# Altium project osu_keyboard.PrjPcb
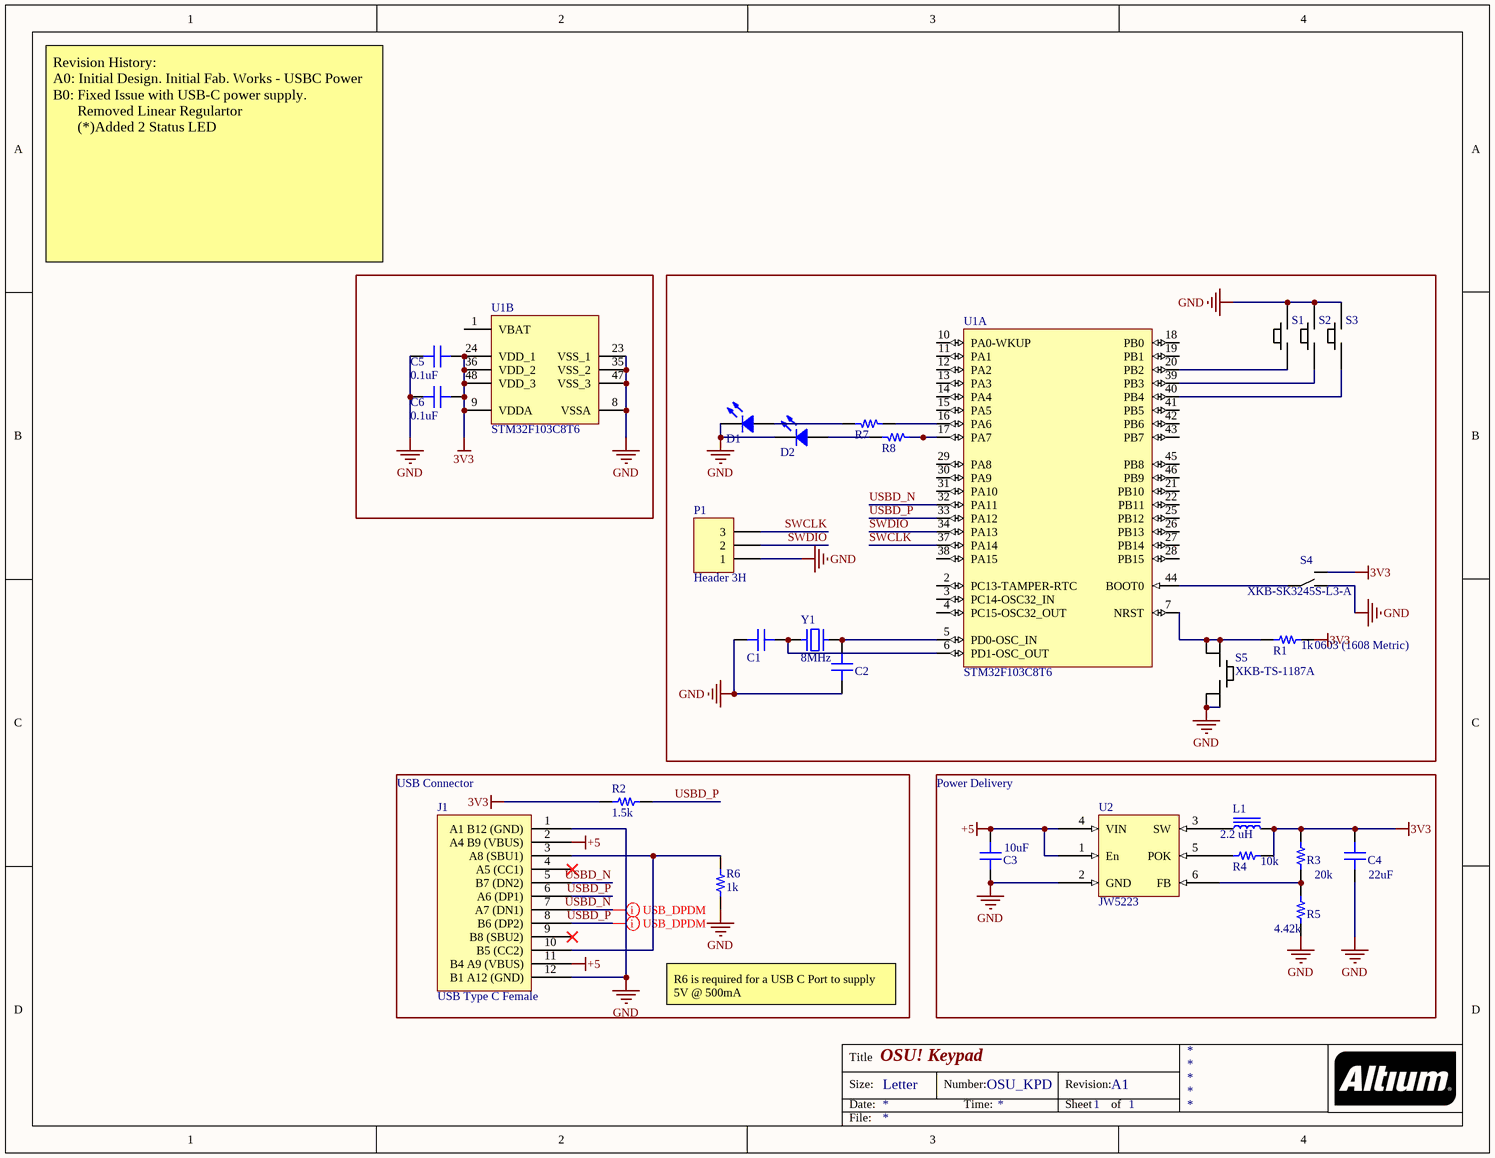
[diagram p0: osu_keyboard.SchDoc]
1 sheet, 27 parts. Net scope: global (net labels, ports and power ports of the same name join across sheets).
Board file: OSU_KBD.PcbDoc

## Sheet osu_keyboard.SchDoc: OSU! Keypad
size Letter; DrawnBy: Yaotian Feng; Engineer: Yaotian Feng; DocumentNumber: OSU_KPD; Revision: A1; SheetNumber: 1; SheetTotal: 1

### Parts
C1  22pF  [CAP 0603/1608]  (value not drawn)
C2  22pF  [CAP 0603/1608]  (value not drawn)
C3  10uF  [CAP 0805/2012]
C4  22uF  [CAP 0805/2012]
C5  0.1uF  [CAP 0603/1608]
C6  0.1uF  [CAP 0603/1608]
D1  Green  [LED 0805/2012 GREEN]  (value not drawn)
D2  Blue  [LED 0805/2012 BLUE]  (value not drawn)
J1  USB Type C Female  [USB Type C Female]
L1  2.2 uH  [INDP1722X10N]
P1  Header 3H  [HDR1X3H]
R1  1k  Device Package: 0603 (1608 Metric)  [RES 0603/1608]
R2  1.5k  [RES 0603/1608]
R3  20k  [RES 0805/2012]
R4  10k  [RES 0805/2012]
R5  4.42k  [RES 0805/2012]
R6  1k  [RES 0603/1608]
R7  330  [RES 0603/1608]  (value not drawn)
R8  330  [RES 0603/1608]  (value not drawn)
S1  CherryMXSwitch  [CherryMX]  (value not drawn)
S2  CherryMXSwitch  [CherryMX]  (value not drawn)
S3  CherryMXSwitch  [CherryMX]  (value not drawn)
S4  XKB-SK3245S-L3-A  [XKB-SK-3245S]
S5  XKB-TS-1187A  [XKB-RS-1187A]
U1  STM32F103C8T6  [STM-LQFP48_N]  (parts A,B of 2)
U2  JW5223  [SOT23-6N]
Y1  8MHz  [TAXM_SMD_CRYSTAL]

### Blocks framed on the sheet
USB Connector: J1 R2 R6
Power Delivery: C3 C4 L1 R3-R5 U2

### Nets
3V3: C4.2 C5.2 C6.2 L1.2 R1.2 R2.2 R3.1 R4.2 S4.1 U1.9(VDDA) U1.24(VDD_1) U1.36(VDD_2) U1.48(VDD_3)
+5: C3.2 J1.2(A4_B9_(VBUS)) J1.11(B4_A9_(VBUS)) U2.1(En) U2.4(VIN)
GND: C1.1 C2.2 C3.1 C4.1 C5.1 C6.1 D1.2 D2.2 J1.1(A1_B12_(GND)) J1.12(B1_A12_(GND)) P1.1 R5.1 R6.2 S1.2 S2.2 S3.2 S4.3 S5.3 S5.4 U1.8(VSSA) U1.23(VSS_1) U1.35(VSS_2) U1.47(VSS_3) U2.2(GND)
SWCLK: P1.3 U1.37(PA14)
SWDIO: P1.2 U1.34(PA13)
USBD_N: J1.5(B7_(DN2)) J1.7(A7_(DN1)) U1.32(PA11)
USBD_P: J1.6(A6_(DP1)) J1.8(B6_(DP2)) R2.1 U1.33(PA12)
NetC1_2: C1.2 U1.6(PD1-OSC_OUT) Y1.1
NetC2_1: C2.1 U1.5(PD0-OSC_IN) Y1.3
NetD1_1: D1.1 R7.2
NetD2_1: D2.1 R8.2
NetJ1_3: J1.3(A8_(SBU1)) J1.10(B5_(CC2)) R6.1
NetL1_1: L1.1 U2.3(SW)
NetR1_1: R1.1 S5.1 S5.2 U1.7(NRST)
NetR3_2: R3.2 R5.2 U2.6(FB)
NetR4_1: R4.1 U2.5(POK)
NetR7_1: R7.1 U1.16(PA6)
NetR8_1: R8.1 U1.17(PA7)
NetS1_1: S1.1 U1.20(PB2)
NetS2_1: S2.1 U1.39(PB3)
NetS3_1: S3.1 U1.40(PB4)
NetS4_2: S4.2 U1.44(BOOT0)

Not connected (* = marked no-connect by the designer): J1 4(A5_(CC1))* 9(B8_(SBU2))*; U1 1(VBAT) 2(PC13-TAMPER-RTC) 3(PC14-OSC32_IN) 4(PC15-OSC32_OUT) 10(PA0-WKUP) 11(PA1) 12(PA2) 13(PA3) 14(PA4) 15(PA5) 18(PB0) 19(PB1) 21(PB10) 22(PB11) 25(PB12) 26(PB13) 27(PB14) 28(PB15) 29(PA8) 30(PA9) 31(PA10) 38(PA15) 41(PB5) 42(PB6) 43(PB7) 45(PB8) 46(PB9)

### Layout directives
differential pair: USBD_N, USBD_P

### Notes on the sheet
- Revision History:
  A0: Initial Design. Initial Fab. Works - USBC Power
  B0: Fixed Issue with USB-C power supply.
  Removed Linear Regulartor
  (*)Added 2 Status LED
- R6 is required for a USB C Port to supply 5V @ 500mA
- Title
- Size:
- Date:
- Letter
- Number:
- Time:
- Revision:
- Sheet
- of
- File:

### Library data of the parts
C1 C2 = C1608C0G1H220J080AA: CAP CER 22PF 50V C0G 0603; Manufacturer: TDK Corporation; TemperatureRange: -55C ~ 125C; TemperatureCoefficient: C0G, NP0; Tolerance: 5%; Value: 22pF; PartId: 4031; Part Number: C1608C0G1H220J080AA; Supplier 1: Digi-Key; Supplier Part Number 1: 445-1273-1-ND; ComponentLink1Description: Datasheet; ComponentLink1URL: https://product.tdk.com/info/en/catalog/datasheets/mlcc_commercial_general_en.pdf; ComponentLink2Description: Digi-Key listing; ComponentLink2URL: http://digikey.com/product-detail/en/C1608C0G1H220J080AA/445-1273-1-ND/567670; Voltage: 50V; Price: 0.14; Type: -; Device Package: 0603 (1608 Metric)
C3 = C2012X5R0J106K125AB: CAP CER 10UF 6.3V X5R 0805; Manufacturer: TDK Corporation; TemperatureRange: -55C ~ 85C; Tolerance: 10%; Value: 10uF; PartId: 4503; Part Number: C2012X5R0J106K125AB; Supplier 1: Digi-Key; Supplier Part Number 1: 445-4113-2-ND; ComponentLink1Description: Datasheet; ComponentLink1URL: https://product.tdk.com/info/en/catalog/datasheets/mlcc_commercial_general_en.pdf; ComponentLink2Description: Digi-Key listing; ComponentLink2URL: http://digikey.com/product-detail/en/C2012X5R0J106K125AB/445-4113-2-ND/1975460; TemperatureCoefficient: X5R; Voltage: 6.3V; Price: 0.0486; Type: -; Device Package: 0805 (2012 Metric)
C4 = C0805C226M9PACTU: CAP CER 22UF 6.3V X5R 0805; Manufacturer: Kemet; TemperatureRange: -55C ~ 85C; Tolerance: 20%; Value: 22uF; PartId: 13904; Part Number: C0805C226M9PACTU; Supplier 1: Digi-Key; Supplier Part Number 1: 399-4696-2-ND; ComponentLink1Description: Datasheet; ComponentLink1URL: http://www.kemet.com/docfinder?Partnumber=C0805C226M9PACTU; ComponentLink2Description: Digi-Key Listing; ComponentLink2URL: https://www.digikey.com/product-detail/en/kemet/C0805C226M9PACTU/399-4696-2-ND/992189; TemperatureCoefficient: X5R; Voltage: 6.3V; Price: 0.076; Device Package: 0805 (2012 Metric)
C5 C6 = C1608X7R1E104K080AA: CAP CER 0.1UF 25V X7R 0603; Manufacturer: TDK Corporation; TemperatureRange: -55C ~ 125C; Tolerance: 10%; Value: 0.1uF; PartId: 4029; Part Number: C1608X7R1E104K080AA; Supplier 1: Digi-Key; Supplier Part Number 1: 445-1316-1-ND; ComponentLink1Description: Datasheet; ComponentLink1URL: https://product.tdk.com/info/en/catalog/datasheets/mlcc_commercial_general_en.pdf; ComponentLink2Description: Digi-Key listing; ComponentLink2URL: http://digikey.com/product-detail/en/C1608X7R1E104K080AA/445-1316-1-ND/567697; TemperatureCoefficient: X7R; Voltage: 25V; Price: 0.14; Type: -; Device Package: 0603 (1608 Metric)
D1 = LTST-C171KGKT: LED GREEN CLEAR 0805 SMD; Manufacturer: Lite-On Inc.; Type: Surface Mount; Millicandela: 35mcd; Voltage Forward: 2V; Current (Test): 20mA; Viewing Angle: 130; Value: Green; PartId: 7080; Part Number: LTST-C171KGKT; Supplier 1: Digi-Key; Supplier Part Number 1: 160-1426-2-ND; ComponentLink1Description: Datasheet; ComponentLink1URL: http://optoelectronics.liteon.com/upload/download/DS22-2000-118/S_110_LTST-C171KGKT.pdf; ComponentLink2Description: Digi-Key Listing; ComponentLink2URL: http://www.digikey.ca/product-detail/en/LTST-C171KGKT/160-1426-2-ND/386799; Price: 0.0638; Device Package: 0805 (2012 Metric); Colour: Green; Lens Transparency: Clear
D2 = LTST-C171TBKT: LED BLUE CLEAR 0805 SMD; Manufacturer: Lite-On Inc.; Value: Green; Type: Surface Mount; Millicandela: 104mcd; Voltage Forward: 3.3V; Current (Test): 20mA; Viewing Angle: 130; PartId: 7084; Part Number: LTST-C171TBKT; Supplier 1: Digi-Key; Supplier Part Number 1: 160-1645-2-ND; ComponentLink1Description: Datasheet; ComponentLink1URL: http://optoelectronics.liteon.com/upload/download/DS22-2000-233/S_110_LTST-C171TBKT(0630).pdf; ComponentLink2Description: Digi-Key Listing; ComponentLink2URL: http://www.digikey.ca/product-detail/en/LTST-C171TBKT/160-1645-2-ND/388528; Price: 0.0939; Device Package: 0805 (2012 Metric); Colour: Blue; Lens Transparency: Clear
L1 = UHP252010NF: Inductor 2.2uH
P1 = Header 3H: Header, 3-Pin, Right Angle; LatestRevisionDate: 17-Jul-2002; LatestRevisionNote: Re-released for DXP Platform.; Publisher: Altium Limited
R1 R6 = ERJ-3EKF1001V: RES SMD 1K OHM 1% 1/10W 0603; Manufacturer: Panasonic Electronic Components; TemperatureRange: -55C ~ 155C; TemperatureCoefficient: 100ppm/C; PowerRating: 0.1W, 1/10W; Value: 1k; PartId: 885; Part Number: ERJ-3EKF1001V; Supplier 1: Digi-Key; Supplier Part Number 1: P1.00KHTR-ND; ComponentLink1Description: Datasheet; ComponentLink1URL: http://industrial.panasonic.com/www-cgi/jvcr13pz.cgi?E+PZ+3+AOA0002+ERJ3EKF1001V+7+WW; ComponentLink2Description: Digi-Key listing; ComponentLink2URL: http://digikey.com/product-detail/en/ERJ-3EKF1001V/P1.00KHTR-ND/196032; Tolerance: 1%; Price: 0.0038; Type: Thick Film
R2 = ERA-3ARW152V: RES SMD 1.5KOHM 0.05% 1/10W 0603; Manufacturer: Panasonic Electronic Components; TemperatureRange: -55C ~ 155C; TemperatureCoefficient: 10ppm/C; PowerRating: 0.1W, 1/10W; Value: 1.5k; PartId: 1863; Part Number: ERA-3ARW152V; Supplier 1: Digi-Key; Supplier Part Number 1: P1.5KBETR-ND; ComponentLink1Description: Datasheet; ComponentLink1URL: http://industrial.panasonic.com/lecs/www-data/pdf/AOA0000/AOA0000CE26.pdf; ComponentLink2Description: Digi-Key listing; ComponentLink2URL: http://digikey.com/product-detail/en/ERA-3ARW152V/P1.5KBETR-ND/3073692; Tolerance: 0.05%; Price: 0.3659; Type: Thin Film; Device Package: 0603 (1608 Metric)
R3 = ERA-6AEB203V: RES SMD 20K OHM 0.1% 1/8W 0805; Manufacturer: Panasonic Electronic Components; TemperatureRange: -55C ~ 155C; TemperatureCoefficient: 25ppm/C; PowerRating: 0.125W, 1/8W; Value: 20k; PartId: 2456; Part Number: ERA-6AEB203V; Supplier 1: Digi-Key; Supplier Part Number 1: P20KDATR-ND; ComponentLink1Description: Datasheet; ComponentLink1URL: http://industrial.panasonic.com/lecs/www-data/pdf/AOA0000/AOA0000CE26.pdf; ComponentLink2Description: Digi-Key listing; ComponentLink2URL: http://digikey.com/product-detail/en/ERA-6AEB203V/P20KDATR-ND/1465780; Tolerance: 0.1%; Price: 0.0653; Type: Thin Film; Device Package: 0805 (2012 Metric)
R4 = ERA-6AEB103V: RES SMD 10K OHM 0.1% 1/8W 0805; Manufacturer: Panasonic Electronic Components; TemperatureRange: -55C ~ 155C; TemperatureCoefficient: 25ppm/C; PowerRating: 0.125W, 1/8W; Value: 10k; PartId: 2446; Part Number: ERA-6AEB103V; Supplier 1: Digi-Key; Supplier Part Number 1: P10KDATR-ND; ComponentLink1Description: Datasheet; ComponentLink1URL: http://industrial.panasonic.com/lecs/www-data/pdf/AOA0000/AOA0000CE26.pdf; ComponentLink2Description: Digi-Key listing; ComponentLink2URL: http://digikey.com/product-detail/en/ERA-6AEB103V/P10KDATR-ND/1465773; Tolerance: 0.1%; Price: 0.0653; Type: Thin Film; Device Package: 0805 (2012 Metric)
R5 = ERA-6AEB4421V: RES SMD 4.42K OHM 0.1% 1/8W 0805; Manufacturer: Panasonic Electronic Components; TemperatureRange: -55C ~ 155C; TemperatureCoefficient: 25ppm/C; PowerRating: 0.125W, 1/8W; Value: 4.42k; PartId: 2618; Part Number: ERA-6AEB4421V; Supplier 1: Digi-Key; Supplier Part Number 1: P4.42KDATR-ND; ComponentLink1Description: Datasheet; ComponentLink1URL: http://industrial.panasonic.com/lecs/www-data/pdf/AOA0000/AOA0000CE26.pdf; ComponentLink2Description: Digi-Key listing; ComponentLink2URL: http://digikey.com/product-detail/en/ERA-6AEB4421V/P4.42KDATR-ND/2025721; Tolerance: 0.1%; Price: 0.0653; Type: Thin Film; Device Package: 0805 (2012 Metric)
R7 R8 = ERJ-PA3F3300V: RES SMD 330 OHM 1% 1/4W 0603; Manufacturer: Panasonic Electronic Components; TemperatureRange: -55C ~ 155C; TemperatureCoefficient: 100ppm/C; PowerRating: 0.25W, 1/4W; Value: 330; PartId: 1800; Part Number: ERJ-PA3F3300V; Supplier 1: Digi-Key; Supplier Part Number 1: P330BYTR-ND; ComponentLink1Description: Datasheet; ComponentLink1URL: http://industrial.panasonic.com/www-cgi/jvcr17pz.cgi?E+PZ+4+AOA0004+ERJPA3F3300V+WW; ComponentLink2Description: Digi-Key listing; ComponentLink2URL: http://digikey.com/product-detail/en/ERJ-PA3F3300V/P330BYTR-ND/5035908; Tolerance: 1%; Price: 0.0255; Type: Thick Film; Device Package: 0603 (1608 Metric)
S1-S3 = CherryMXSwitch: CherryMX Switch
S4 = XKB-SK3245S-L3-A: Toggle Switch
S5 = XKB-TS-1187A: Push Button
U1 = STM32F103C8T6: ARM Cortex-M3 32-bit MCU, 64 KB Flash, 20 KB Internal RAM, 37 I/Os, 48-pin LQFP, -40 to 85 degC, Tray; A/D Converter: 2x12-bit (10 Channel); FLASH Size (Prog) (kB): 64; I/Os (High Current): 37; Internal RAM Size (kB): 20; Operating Frequency(F) (Processor speed) (MHz): 72; Supply Voltage(Vcc) min (V): 2; DatasheetVersion: Rev. 16; PackageVersion: Rev. 6, 06/2013; PackageReference: LQFP48; PackageDescription: 48-Pin Low Profile Quad Flat Package, 7 x 7 mm Body, 0.5 mm Pitch; Supplier 1: Digi-Key; Supplier Part Number 1: 497-6063-ND; Supplier 2: Farnell; Supplier Part Number 2: 1447637; Supplier 3: Newark; Supplier Part Number 3: 59M2182; Supplier 4: Newark; Supplier Part Number 4: 57P1222; Supplier 5: Mouser; Supplier Part Number 5: 511-STM32F103C8T6; Core: ARM Cortex-M3; Packing: Tray; Mounting Technology: Surface Mount; PartNumber: STM32F103C8T6; ComponentLink1Description: Manufacturer URL; ComponentLink1URL: http://www.st.com/web/en/home.html; ComponentLink2Description: Datasheet; ComponentLink2URL: http://www.st.com/st-web-ui/static/active/en/resource/technical/document/datasheet/CD00161566.pdf; ComponentLink3Description: Package Specification; ComponentLink3URL: http://www.st.com/st-web-ui/static/active/en/resource/technical/document/datasheet/DM00058181.pdf
U2 = JW5223: SMPS Buck; ComponentLink1Description: Datasheet; ComponentLink1URL: https://datasheet.lcsc.com/szlcsc/1909111631_JoulWatt-Tech-JW5223_C185110.pdf
Y1 = TAXM8M4RDBCCT2T